# EAGLE design so-indicators-ok (EAGLE 6.6.0)
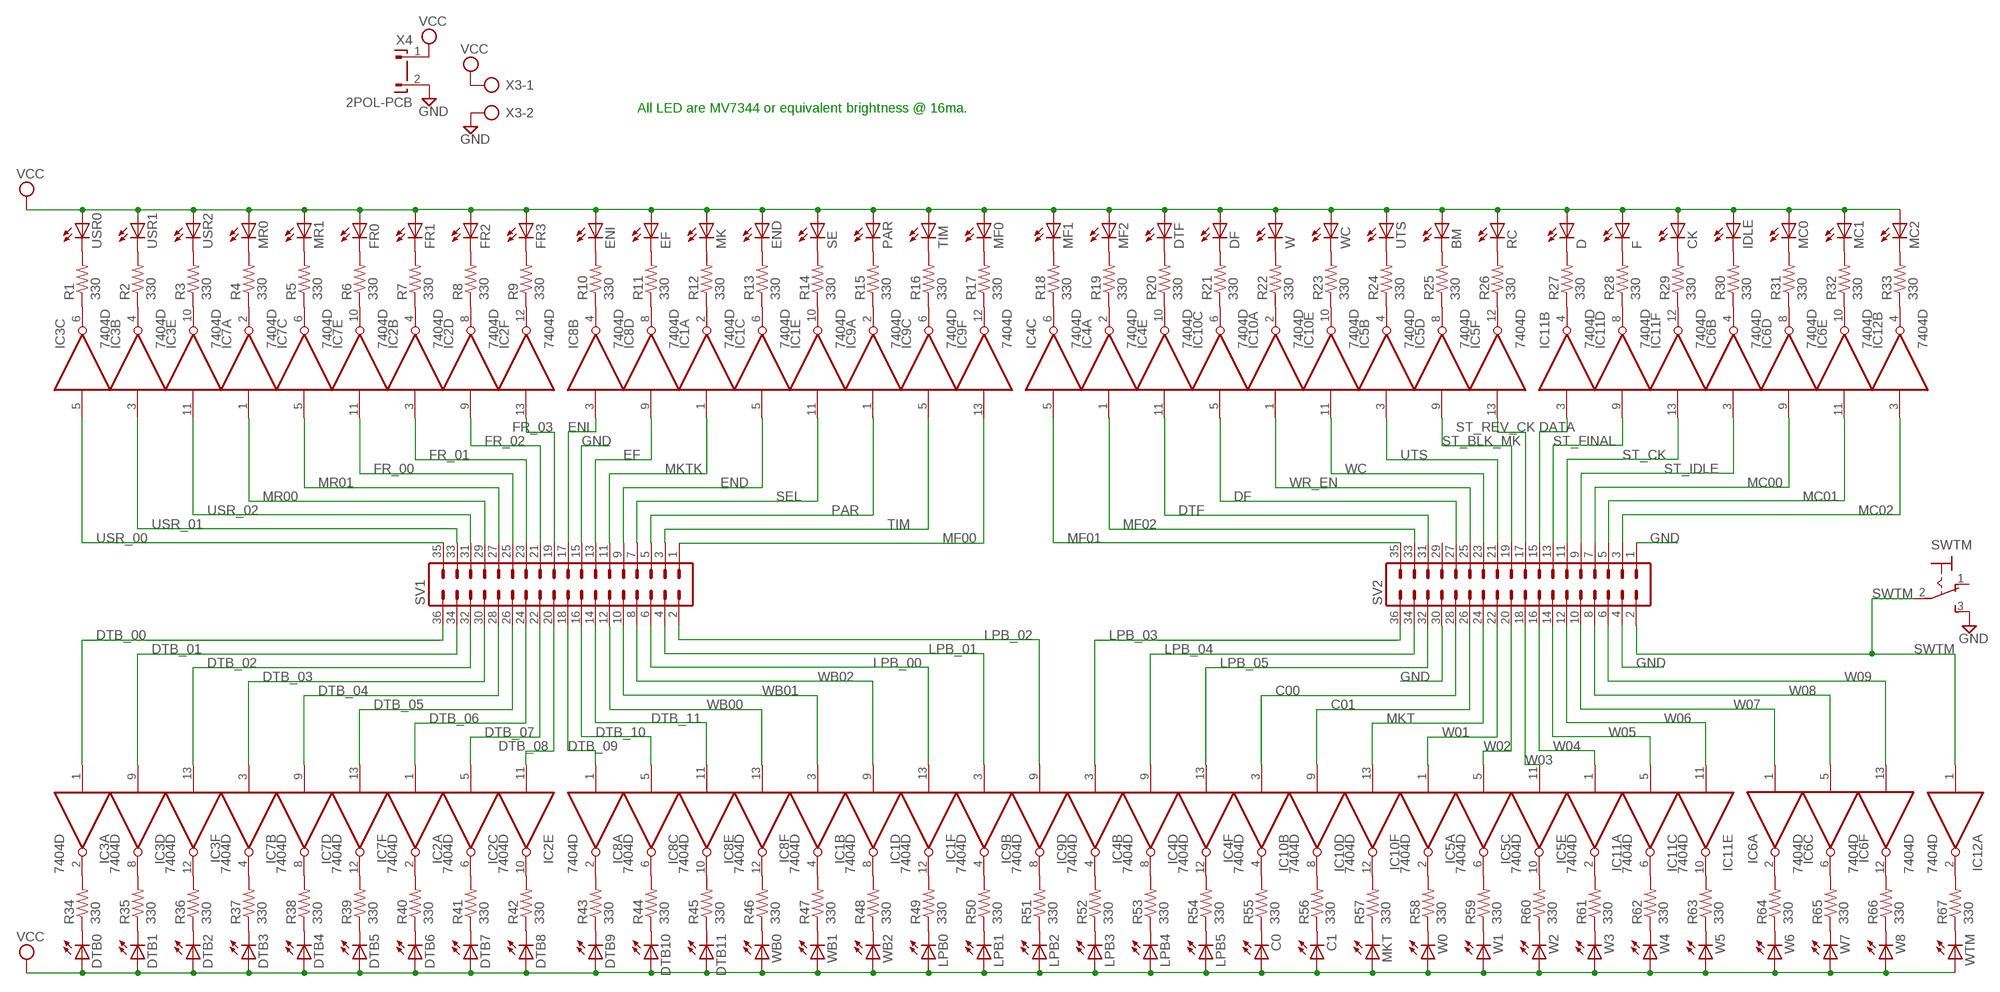
[diagram p0: schematic, sheet 1]

## Parts
BM  LED5MM  [LED5MM]
C0  LED5MM  [LED5MM]
C1  LED5MM  [LED5MM]
CK  LED5MM  [LED5MM]
D  LED5MM  [LED5MM]
DF  LED5MM  [LED5MM]
DTB0  LED5MM  [LED5MM]
DTB1  LED5MM  [LED5MM]
DTB2  LED5MM  [LED5MM]
DTB3  LED5MM  [LED5MM]
DTB4  LED5MM  [LED5MM]
DTB5  LED5MM  [LED5MM]
DTB6  LED5MM  [LED5MM]
DTB7  LED5MM  [LED5MM]
DTB8  LED5MM  [LED5MM]
DTB9  LED5MM  [LED5MM]
DTB10  LED5MM  [LED5MM]
DTB11  LED5MM  [LED5MM]
DTF  LED5MM  [LED5MM]
EF  LED5MM  [LED5MM]
END  LED5MM  [LED5MM]
ENI  LED5MM  [LED5MM]
F  LED5MM  [LED5MM]
FR0  LED5MM  [LED5MM]
FR1  LED5MM  [LED5MM]
FR2  LED5MM  [LED5MM]
FR3  LED5MM  [LED5MM]
IC1  7404D  [SO14]
IC2  7404D  [SO14]
IC3  7404D  [SO14]
IC4  7404D  [SO14]
IC5  7404D  [SO14]
IC6  7404D  [SO14]
IC7  7404D  [SO14]
IC8  7404D  [SO14]
IC9  7404D  [SO14]
IC10  7404D  [SO14]
IC11  7404D  [SO14]
IC12  7404D  [SO14]
IDLE  LED5MM  [LED5MM]
LPB0  LED5MM  [LED5MM]
LPB1  LED5MM  [LED5MM]
LPB2  LED5MM  [LED5MM]
LPB3  LED5MM  [LED5MM]
LPB4  LED5MM  [LED5MM]
LPB5  LED5MM  [LED5MM]
MC0  LED5MM  [LED5MM]
MC1  LED5MM  [LED5MM]
MC2  LED5MM  [LED5MM]
MF0  LED5MM  [LED5MM]
MF1  LED5MM  [LED5MM]
MF2  LED5MM  [LED5MM]
MK  LED5MM  [LED5MM]
MKT  LED5MM  [LED5MM]
MR0  LED5MM  [LED5MM]
MR1  LED5MM  [LED5MM]
PAR  LED5MM  [LED5MM]
R1  330  R-US_0207/10  [0207/10]
R2  330  R-US_0207/10  [0207/10]
R3  330  R-US_0207/10  [0207/10]
R4  330  R-US_0207/10  [0207/10]
R5  330  R-US_0207/10  [0207/10]
R6  330  R-US_0207/10  [0207/10]
R7  330  R-US_0207/10  [0207/10]
R8  330  R-US_0207/10  [0207/10]
R9  330  R-US_0207/10  [0207/10]
R10  330  R-US_0207/10  [0207/10]
R11  330  R-US_0207/10  [0207/10]
R12  330  R-US_0207/10  [0207/10]
R13  330  R-US_0207/10  [0207/10]
R14  330  R-US_0207/10  [0207/10]
R15  330  R-US_0207/10  [0207/10]
R16  330  R-US_0207/10  [0207/10]
R17  330  R-US_0207/10  [0207/10]
R18  330  R-US_0207/10  [0207/10]
R19  330  R-US_0207/10  [0207/10]
R20  330  R-US_0207/10  [0207/10]
R21  330  R-US_0207/10  [0207/10]
R22  330  R-US_0207/10  [0207/10]
R23  330  R-US_0207/10  [0207/10]
R24  330  R-US_0207/10  [0207/10]
R25  330  R-US_0207/10  [0207/10]
R26  330  R-US_0207/10  [0207/10]
R27  330  R-US_0207/10  [0207/10]
R28  330  R-US_0207/10  [0207/10]
R29  330  R-US_0207/10  [0207/10]
R30  330  R-US_0207/10  [0207/10]
R31  330  R-US_0207/10  [0207/10]
R32  330  R-US_0207/10  [0207/10]
R33  330  R-US_0207/10  [0207/10]
R34  330  R-US_0207/10  [0207/10]
R35  330  R-US_0207/10  [0207/10]
R36  330  R-US_0207/10  [0207/10]
R37  330  R-US_0207/10  [0207/10]
R38  330  R-US_0207/10  [0207/10]
R39  330  R-US_0207/10  [0207/10]
R40  330  R-US_0207/10  [0207/10]
R41  330  R-US_0207/10  [0207/10]
R42  330  R-US_0207/10  [0207/10]
R43  330  R-US_0207/10  [0207/10]
R44  330  R-US_0207/10  [0207/10]
R45  330  R-US_0207/10  [0207/10]
R46  330  R-US_0207/10  [0207/10]
R47  330  R-US_0207/10  [0207/10]
R48  330  R-US_0207/10  [0207/10]
R49  330  R-US_0207/10  [0207/10]
R50  330  R-US_0207/10  [0207/10]
R51  330  R-US_0207/10  [0207/10]
R52  330  R-US_0207/10  [0207/10]
R53  330  R-US_0207/10  [0207/10]
R54  330  R-US_0207/10  [0207/10]
R55  330  R-US_0207/10  [0207/10]
R56  330  R-US_0207/10  [0207/10]
R57  330  R-US_0207/10  [0207/10]
R58  330  R-US_0207/10  [0207/10]
R59  330  R-US_0207/10  [0207/10]
R60  330  R-US_0207/10  [0207/10]
R61  330  R-US_0207/10  [0207/10]
R62  330  R-US_0207/10  [0207/10]
R63  330  R-US_0207/10  [0207/10]
R64  330  R-US_0207/10  [0207/10]
R65  330  R-US_0207/10  [0207/10]
R66  330  R-US_0207/10  [0207/10]
R67  330  R-US_0207/10  [0207/10]
RC  LED5MM  [LED5MM]
SE  LED5MM  [LED5MM]
SV1  MA18-2  [MA18-2]
SV2  MA18-2  [MA18-2]
SWTM  M9040P  [M9040P]
TIM  LED5MM  [LED5MM]
USR0  LED5MM  [LED5MM]
USR1  LED5MM  [LED5MM]
USR2  LED5MM  [LED5MM]
UTS  LED5MM  [LED5MM]
W  LED5MM  [LED5MM]
W0  LED5MM  [LED5MM]
W1  LED5MM  [LED5MM]
W2  LED5MM  [LED5MM]
W3  LED5MM  [LED5MM]
W4  LED5MM  [LED5MM]
W5  LED5MM  [LED5MM]
W6  LED5MM  [LED5MM]
W7  LED5MM  [LED5MM]
W8  LED5MM  [LED5MM]
WB0  LED5MM  [LED5MM]
WB1  LED5MM  [LED5MM]
WB2  LED5MM  [LED5MM]
WC  LED5MM  [LED5MM]
WTM  LED5MM  [LED5MM]
X3  AK300/2  [AK300/2]
X4  2POL-PCB  [2POL-PCB]

## Nets
C00: IC10.3(B:I) SV2.28
C01: IC10.9(D:I) SV2.26
DATA: IC11.3(B:I) SV2.15
DF: IC10.5(C:I) SV2.27
DTB_00: IC3.1(A:I) SV1.36
DTB_01: IC3.9(D:I) SV1.34
DTB_02: IC3.13(F:I) SV1.32
DTB_03: IC7.3(B:I) SV1.30
DTB_04: IC7.9(D:I) SV1.28
DTB_05: IC7.13(F:I) SV1.26
DTB_06: IC2.1(A:I) SV1.24
DTB_07: IC2.5(C:I) SV1.22
DTB_08: IC2.11(E:I) SV1.20
DTB_09: IC8.1(A:I) SV1.18
DTB_10: IC8.5(C:I) SV1.16
DTB_11: IC8.11(E:I) SV1.14
DTF: IC4.11(E:I) SV2.31
EF: IC8.9(D:I) SV1.13
END: IC1.5(C:I) SV1.9
ENI: IC8.3(B:I) SV1.17
FR_00: IC7.11(E:I) SV1.25
FR_01: IC2.3(B:I) SV1.23
FR_02: IC2.9(D:I) SV1.21
FR_03: IC2.13(F:I) SV1.19
GND: SV1.15 SV2.1 SV2.4 SV2.30 SWTM.3(S) X3.2 X4.2
LPB_00: IC1.13(F:I) SV1.6
LPB_01: IC9.3(B:I) SV1.4
LPB_02: IC9.9(D:I) SV1.2
LPB_03: IC4.3(B:I) SV2.36
LPB_04: IC4.9(D:I) SV2.34
LPB_05: IC4.13(F:I) SV2.32
MC00: IC6.9(D:I) SV2.7
MC01: IC6.11(E:I) SV2.5
MC02: IC12.3(B:I) SV2.3
MF00: IC9.13(F:I) SV1.1
MF01: IC4.5(C:I) SV2.35
MF02: IC4.1(A:I) SV2.33
MKT: IC10.13(F:I) SV2.24
MKTK: IC1.1(A:I) SV1.11
MR00: IC7.1(A:I) SV1.29
MR01: IC7.5(C:I) SV1.27
N$1: R1.2 USR0.K(C)
N$2: R2.2 USR1.K(C)
N$3: R3.2 USR2.K(C)
N$4: MR0.K(C) R4.2
N$5: MR1.K(C) R5.2
N$6: FR0.K(C) R6.2
N$7: FR1.K(C) R7.2
N$8: FR2.K(C) R8.2
N$9: FR3.K(C) R9.2
N$10: ENI.K(C) R10.2
N$11: EF.K(C) R11.2
N$12: MK.K(C) R12.2
N$13: END.K(C) R13.2
N$14: R14.2 SE.K(C)
N$15: PAR.K(C) R15.2
N$16: R16.2 TIM.K(C)
N$17: MF0.K(C) R17.2
N$18: MF1.K(C) R18.2
N$19: MF2.K(C) R19.2
N$20: IC3.6(C:O) R1.1
N$21: IC3.4(B:O) R2.1
N$22: IC3.10(E:O) R3.1
N$23: IC7.2(A:O) R4.1
N$24: IC7.6(C:O) R5.1
N$25: IC7.10(E:O) R6.1
N$26: IC2.4(B:O) R7.1
N$27: IC2.8(D:O) R8.1
N$28: IC2.12(F:O) R9.1
N$29: IC8.4(B:O) R10.1
N$30: IC8.8(D:O) R11.1
N$31: IC1.2(A:O) R12.1
N$32: IC1.6(C:O) R13.1
N$33: IC1.10(E:O) R14.1
N$34: IC9.2(A:O) R15.1
N$35: IC9.6(C:O) R16.1
N$36: IC9.12(F:O) R17.1
N$37: IC4.6(C:O) R18.1
N$38: DTF.K(C) R20.2
N$57: DF.K(C) R21.2
N$58: R22.2 W.K(C)
N$59: R23.2 WC.K(C)
N$60: R24.2 UTS.K(C)
N$61: BM.K(C) R25.2
N$62: R26.2 RC.K(C)
N$63: D.K(C) R27.2
N$64: F.K(C) R28.2
N$65: CK.K(C) R29.2
N$66: IDLE.K(C) R30.2
N$67: MC0.K(C) R31.2
N$68: MC1.K(C) R32.2
N$69: MC2.K(C) R33.2
N$70: IC4.2(A:O) R19.1
N$71: IC4.10(E:O) R20.1
N$72: IC10.6(C:O) R21.1
N$73: IC10.10(E:O) R23.1
N$74: IC10.2(A:O) R22.1
N$75: IC5.4(B:O) R24.1
N$76: IC5.8(D:O) R25.1
N$77: IC5.12(F:O) R26.1
N$78: IC11.4(B:O) R27.1
N$79: IC11.8(D:O) R28.1
N$80: IC11.12(F:O) R29.1
N$81: IC6.4(B:O) R30.1
N$82: IC6.8(D:O) R31.1
N$83: IC6.10(E:O) R32.1
N$84: IC12.4(B:O) R33.1
N$89: DTB0.K(C) R34.1
N$90: DTB1.K(C) R35.1
N$91: DTB2.K(C) R36.1
N$92: DTB3.K(C) R37.1
N$93: DTB4.K(C) R38.1
N$94: DTB5.K(C) R39.1
N$95: DTB6.K(C) R40.1
N$96: DTB7.K(C) R41.1
N$97: DTB8.K(C) R42.1
N$98: DTB9.K(C) R43.1
N$99: DTB10.K(C) R44.1
N$100: DTB11.K(C) R45.1
N$101: R46.1 WB0.K(C)
N$102: R47.1 WB1.K(C)
N$103: R48.1 WB2.K(C)
N$104: LPB0.K(C) R49.1
N$105: LPB1.K(C) R50.1
N$106: LPB2.K(C) R51.1
N$107: LPB3.K(C) R52.1
N$108: LPB4.K(C) R53.1
N$109: LPB5.K(C) R54.1
N$110: C0.K(C) R55.1
N$111: C1.K(C) R56.1
N$112: MKT.K(C) R57.1
N$113: R58.1 W0.K(C)
N$114: R59.1 W1.K(C)
N$115: R60.1 W2.K(C)
N$116: R61.1 W3.K(C)
N$117: R62.1 W4.K(C)
N$118: R63.1 W5.K(C)
N$119: R64.1 W6.K(C)
N$120: R65.1 W7.K(C)
N$121: R66.1 W8.K(C)
N$122: R67.1 WTM.K(C)
N$123: IC3.2(A:O) R34.2
N$124: IC3.8(D:O) R35.2
N$125: IC3.12(F:O) R36.2
N$126: IC7.4(B:O) R37.2
N$127: IC7.8(D:O) R38.2
N$128: IC7.12(F:O) R39.2
N$129: IC2.2(A:O) R40.2
N$130: IC2.6(C:O) R41.2
N$131: IC2.10(E:O) R42.2
N$132: IC8.2(A:O) R43.2
N$133: IC8.6(C:O) R44.2
N$134: IC8.10(E:O) R45.2
N$135: IC8.12(F:O) R46.2
N$136: IC1.4(B:O) R47.2
N$137: IC1.8(D:O) R48.2
N$138: IC1.12(F:O) R49.2
N$139: IC9.4(B:O) R50.2
N$140: IC9.8(D:O) R51.2
N$141: IC4.4(B:O) R52.2
N$142: IC4.8(D:O) R53.2
N$143: IC4.12(F:O) R54.2
N$144: IC10.4(B:O) R55.2
N$145: IC10.8(D:O) R56.2
N$146: IC10.12(F:O) R57.2
N$147: IC5.2(A:O) R58.2
N$148: IC5.6(C:O) R59.2
N$149: IC5.10(E:O) R60.2
N$150: IC11.2(A:O) R61.2
N$151: IC11.6(C:O) R62.2
N$152: IC11.10(E:O) R63.2
N$153: IC6.2(A:O) R64.2
N$154: IC6.6(C:O) R65.2
N$155: IC6.12(F:O) R66.2
N$190: IC12.2(A:O) R67.2
PAR: IC9.1(A:I) SV1.5
SEL: IC1.11(E:I) SV1.7
ST_BLK_MK: IC5.9(D:I) SV2.19
ST_CK: IC11.13(F:I) SV2.11
ST_FINAL: IC11.9(D:I) SV2.13
ST_IDLE: IC6.3(B:I) SV2.9
ST_REV_CK: IC5.13(F:I) SV2.17
SWTM: IC12.1(A:I) SV2.2 SWTM.2(P)
TIM: IC9.5(C:I) SV1.3
USR_00: IC3.5(C:I) SV1.35
USR_01: IC3.3(B:I) SV1.33
USR_02: IC3.11(E:I) SV1.31
UTS: IC5.3(B:I) SV2.21
VCC: BM.A C0.A C1.A CK.A D.A DF.A DTB0.A DTB1.A DTB2.A DTB3.A DTB4.A DTB5.A DTB6.A DTB7.A DTB8.A DTB9.A DTB10.A DTB11.A DTF.A EF.A END.A ENI.A F.A FR0.A FR1.A FR2.A FR3.A IDLE.A LPB0.A LPB1.A LPB2.A LPB3.A LPB4.A LPB5.A MC0.A MC1.A MC2.A MF0.A MF1.A MF2.A MK.A MKT.A MR0.A MR1.A PAR.A RC.A SE.A TIM.A USR0.A USR1.A USR2.A UTS.A W0.A W1.A W2.A W3.A W4.A W5.A W6.A W7.A W8.A W.A WB0.A WB1.A WB2.A WC.A WTM.A X3.1 X4.1
W01: IC5.1(A:I) SV2.22
W02: IC5.5(C:I) SV2.20
W03: IC5.11(E:I) SV2.18
W04: IC11.1(A:I) SV2.16
W05: IC11.5(C:I) SV2.14
W06: IC11.11(E:I) SV2.12
W07: IC6.1(A:I) SV2.10
W08: IC6.5(C:I) SV2.8
W09: IC6.13(F:I) SV2.6
WB00: IC8.13(F:I) SV1.12
WB01: IC1.3(B:I) SV1.10
WB02: IC1.9(D:I) SV1.8
WC: IC10.11(E:I) SV2.23
WR_EN: IC10.1(A:I) SV2.25
Unconnected: IC9.10(E:O) IC9.11(E:I) IC12.5(C:I) IC12.6(C:O) IC12.8(D:O) IC12.9(D:I) IC12.10(E:O) IC12.11(E:I) IC12.12(F:O) IC12.13(F:I) SV2.29 SWTM.1(O)

## Notes on the sheet
- All LED are MV7344 or equivalent brightness @ 16ma.

## Power pins joined to a net without a drawn wire
GND: IC1.7(P:GND) IC2.7(P:GND) IC3.7(P:GND) IC4.7(P:GND) IC5.7(P:GND) IC6.7(P:GND) IC7.7(P:GND) IC8.7(P:GND) IC9.7(P:GND) IC10.7(P:GND) IC11.7(P:GND) IC12.7(P:GND)
VCC: IC1.14(P:VCC) IC2.14(P:VCC) IC3.14(P:VCC) IC4.14(P:VCC) IC5.14(P:VCC) IC6.14(P:VCC) IC7.14(P:VCC) IC8.14(P:VCC) IC9.14(P:VCC) IC10.14(P:VCC) IC11.14(P:VCC) IC12.14(P:VCC)

## Library data of the parts
BM C0 C1 CK D DF DTB0 DTB1-DTB11 DTF EF END ENI F FR0 FR1-FR3 IDLE LPB0 LPB1-LPB5 MC0 MC1 MC2 MF0 MF1 MF2 MK MKT MR0 MR1 PAR RC SE TIM USR0 USR1 USR2 UTS W W0 W1-W8 WB0 WB1 WB2 WC WTM = led:LED: LED OSRAM: - CHIPLED LG R971, LG N971, LY N971, LG Q971, LY Q971, LO R971, LY R971 LH N974, LH R974 LS Q976, LO Q976, LY Q976 LO Q996 - Hyper CHIPLED LW Q18S LB Q993, LB Q99A, LB R99A - SideLED LS A670, LO A670, LY A670, LG A670, LP A670 LB A673, LV A673, LT A673, LW A673 LH A674 LY A675 LS A676, LA A676, LO A676, LY A676, LW A676 LS A679, LY A679, LG A679 - Hyper Micro SIDELED® LS Y876, LA Y876, LO Y876, LY Y876 LT Y87S - SmartLED LW L88C, LW L88S LB L89C, LB L89S, LG L890 LS L89K, LO L89K, LY L89K LS L896, LA L896, LO L896, LY L896 - TOPLED LS T670, LO T670, LY T670, LG T670, LP T670 LSG T670, LSP T670, LSY T670, LOP T670, LYG T670 LG T671, LOG T671, LSG T671 LB T673, LV T673, LT T673, LW T673 LH T674 LS T676, LA T676, LO T676, LY T676, LB T676, LH T676, LSB T676, LW T676 LB T67C, LV T67C, LT T67C, LS T67K, LO T67K, LY T67K, LW E67C LS E67B, LA E67B, LO E67B, LY E67B, LB E67C, LV E67C, LT E67C LW T67C LS T679, LY T679, LG T679 LS T770, LO T770, LY T770, LG T770, LP T770 LB T773, LV T773, LT T773, LW T773 LH T774 LS E675, LA E675, LY E675, LS T675 LS T776, LA T776, LO T776, LY T776, LB T776 LHGB T686 LT T68C, LB T68C - Hyper Mini TOPLED® LB M676 - Mini TOPLED Santana® LG M470 LS M47K, LO M47K, LY M47K Source: http://www.osram.convergy.de LUXEON: - LUMILED® LXK2-PW12-R00, LXK2-PW12-S00, LXK2-PW14-U00, LXK2-PW14-V00 LXK2-PM12-R00, LXK2-PM12-S00, LXK2-PM14-U00 LXK2-PE12-Q00, LXK2-PE12-R00, LXK2-PE12-S00, LXK2-PE14-T00, LXK2-PE14-U00 LXK2-PB12-K00, LXK2-PB12-L00, LXK2-PB12-M00, LXK2-PB14-N00, LXK2-PB14-P00, LXK2-PB14-Q00 LXK2-PR12-L00, LXK2-PR12-M00, LXK2-PR14-Q00, LXK2-PR14-R00 LXK2-PD12-Q00, LXK2-PD12-R00, LXK2-PD12-S00 LXK2-PH12-R00, LXK2-PH12-S00 LXK2-PL12-P00, LXK2-PL12-Q00, LXK2-PL12-R00 Source: www.luxeon.com KINGBRIGHT: KA-3528ASYC Source: www.kingbright.com
IC1-IC12 = 74xx-us:74*04: Hex INVERTER
R1-R67 = rcl:R-US_: RESISTOR, American symbol
SV1 SV2 = con-lstb:MA18-2: PIN HEADER; OC_FARNELL: unknown; OC_NEWARK: unknown
SWTM = switch:M9040P: TOGGLE SWITCH Marquardt
X3 = con-ptr500:AK300/2: CONNECTOR; OC_FARNELL: unknown; OC_NEWARK: unknown
X4 = con-friwo:2POL-PCB: PCB SUPPLY CONNECTOR FRIWO (TEXAS); OC_FARNELL: unknown; OC_NEWARK: unknown

## Board
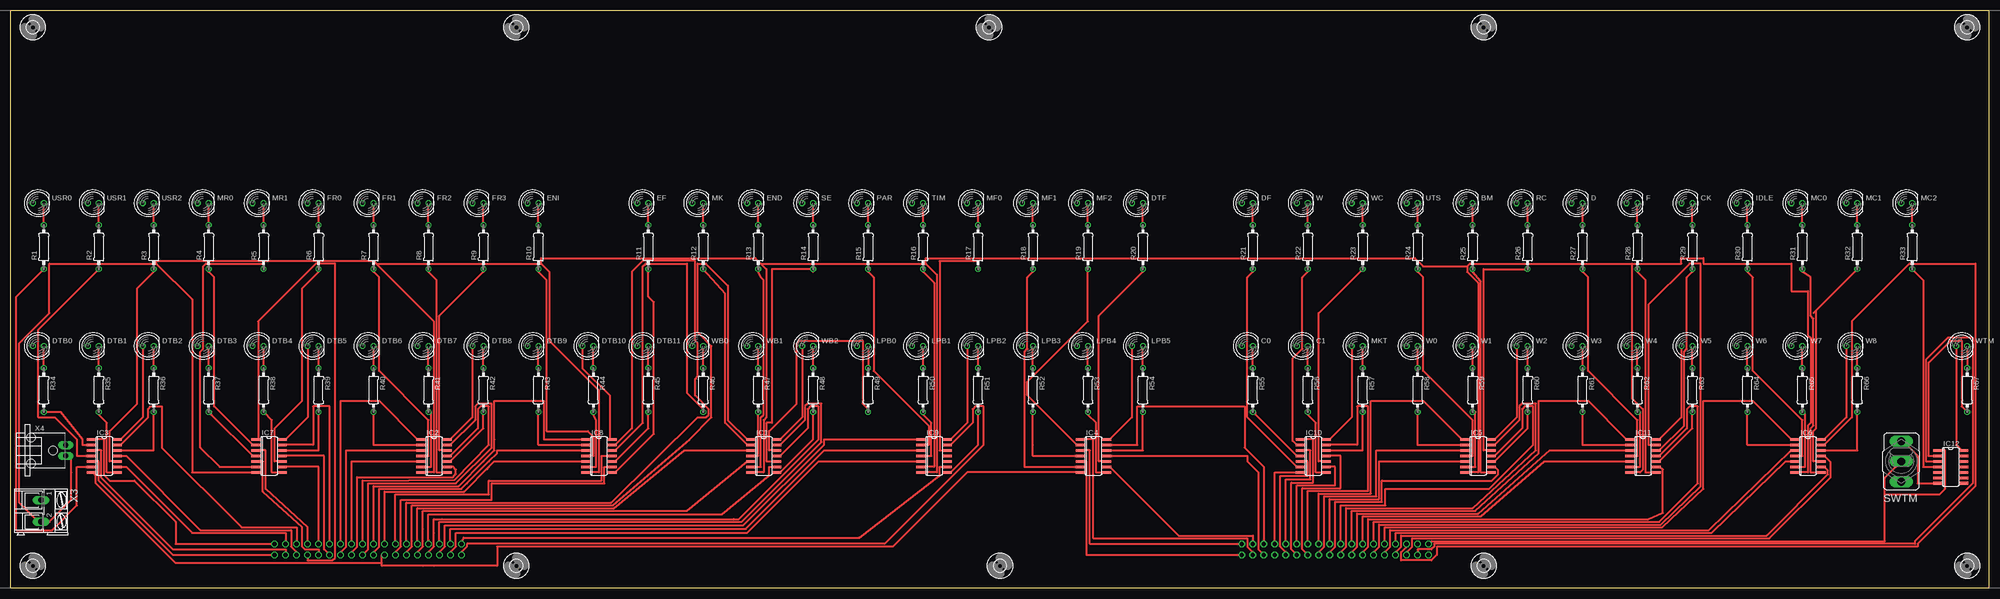
[diagram p1: board, top side]
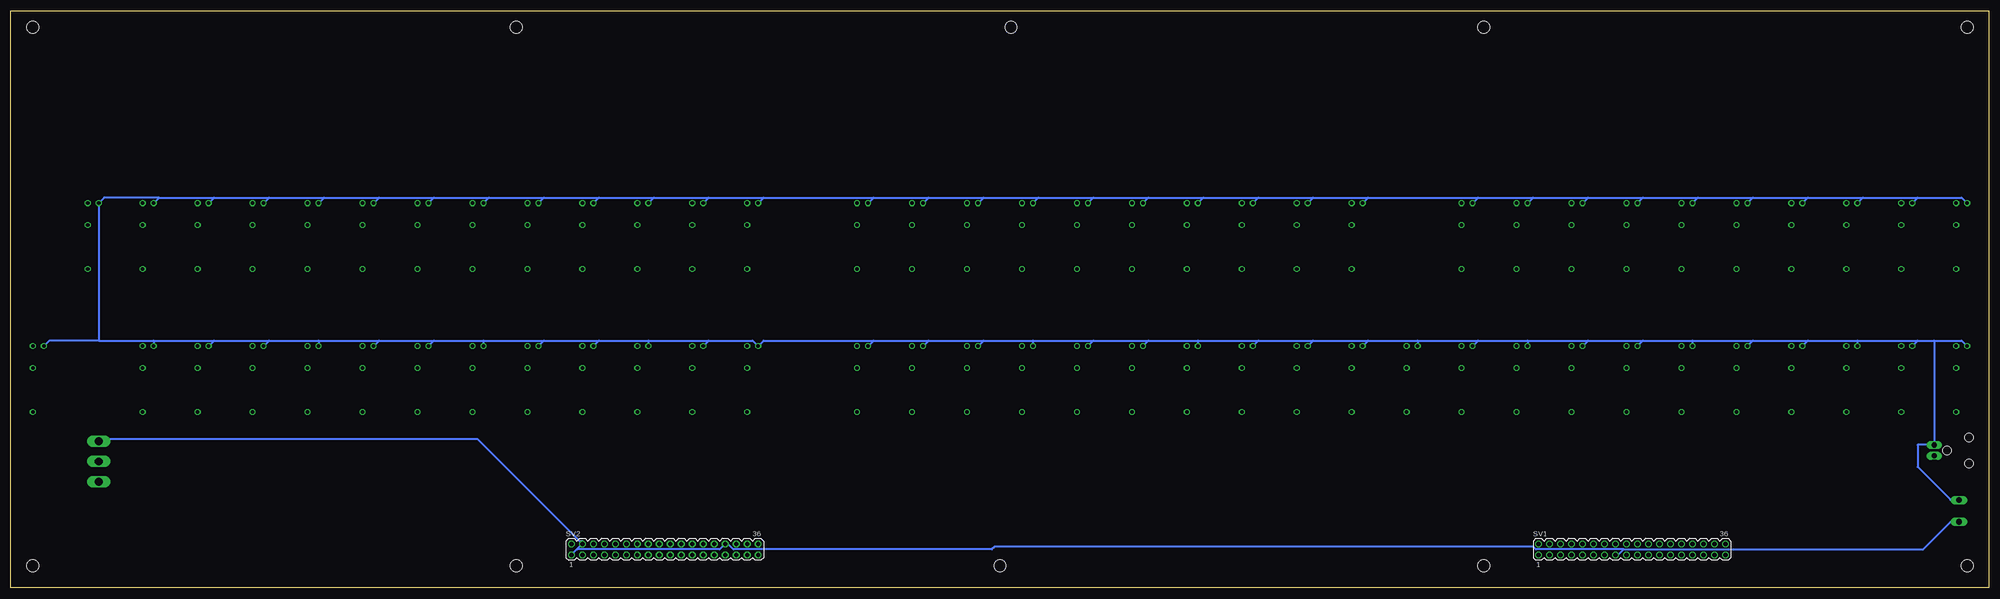
[diagram p2: board, bottom side, seen from below]

Size 457.2 x 133.35 mm. Coordinates in mm from the lower left corner, seen from the top.
Outline: 0,0 457.2,0 457.2,133.35 0,133.35 0,0
Copper layers (1*16): Top 0.035mm / dielectric 1.5mm / Bottom 0.035mm
Design rules "default *": minimum track width 10mil, minimum drill 24mil, track to track 8mil, track to pad 8mil, pad to pad 8mil, via to via 8mil, smd to smd 8mil, copper to edge 40mil, drill to drill 8mil, minimum pad ring 10mil, minimum via ring 8mil, stop-mask expansion 4mil, vias tented up to drill 0mil, thermal gap 10mil

### Footprints (pad centres in the part's own frame; a part is rotated, then mirrored left to right if it is on the bottom)
LED5MM = drill 0.813 octagon: A -1.27,0; K 1.27,0
SO14 = smd 0.66 x 2.032: 1 -3.81,-3.073; 2 -2.54,-3.073; 3 -1.27,-3.073; 4 0,-3.073; 5 1.27,-3.073; 6 2.54,-3.073; 7 3.81,-3.073; 8 3.81,3.073; 9 2.54,3.073; 10 1.27,3.073; 11 0,3.073; 12 -1.27,3.073; 13 -2.54,3.073; 14 -3.81,3.073
0207/10 = drill 0.813 octagon: 1 -5.08,0; 2 5.08,0
MA18-2 = drill 1.016 octagon: 1 -21.59,-1.27; 2 -21.59,1.27; 3 -19.05,-1.27; 4 -19.05,1.27; 5 -16.51,-1.27; 6 -16.51,1.27; 7 -13.97,-1.27; 8 -13.97,1.27; 9 -11.43,-1.27; 10 -11.43,1.27; 11 -8.89,-1.27; 12 -8.89,1.27; 13 -6.35,-1.27; 14 -6.35,1.27; 15 -3.81,-1.27; 16 -3.81,1.27; 17 -1.27,-1.27; 18 -1.27,1.27; 19 1.27,-1.27; 20 1.27,1.27; 21 3.81,-1.27; 22 3.81,1.27; 23 6.35,-1.27; 24 6.35,1.27; 25 8.89,-1.27; 26 8.89,1.27; 27 11.43,-1.27; 28 11.43,1.27; 29 13.97,-1.27; 30 13.97,1.27; 31 16.51,-1.27; 32 16.51,1.27; 33 19.05,-1.27; 34 19.05,1.27; 35 21.59,-1.27; 36 21.59,1.27
M9040P = drill 1.803 long: 1 0,4.699; 2 0,0; 3 0,-4.699
2,8 = hole 2.8: 0,0
AK300/2 = drill 1.321 long: 1 -2.515,0; 2 2.489,0
2POL-PCB = drill 1.2 long: 1 -1.25,11.6; 2 1.25,11.6 | hole 2: -3,3.6; 3,3.6; 0,8.6

### Placement (x,y rotation side)
BM  336.55,88.9 0 top
C0  285.75,55.88 0 top
C1  298.45,55.88 0 top
CK  387.35,88.9 0 top
D  361.95,88.9 0 top
DF  285.75,88.9 0 top
DTB0  6.35,55.88 0 top
DTB1  19.05,55.88 0 top
DTB2  31.75,55.88 0 top
DTB3  44.45,55.88 0 top
DTB4  57.15,55.88 0 top
DTB5  69.85,55.88 0 top
DTB6  82.55,55.88 0 top
DTB7  95.25,55.88 0 top
DTB8  107.95,55.88 0 top
DTB9  120.65,55.88 0 top
DTB10  133.35,55.88 0 top
DTB11  146.05,55.88 0 top
DTF  260.35,88.9 0 top
EF  146.05,88.9 0 top
END  171.45,88.9 0 top
ENI  120.65,88.9 0 top
F  374.65,88.9 0 top
FR0  69.85,88.9 0 top
FR1  82.55,88.9 0 top
FR2  95.25,88.9 0 top
FR3  107.95,88.9 0 top
IC1  173.99,30.48 270 top
IC2  97.79,30.48 270 top
IC3  21.59,30.48 270 top
IC4  250.19,30.48 270 top
IC5  339.09,30.48 270 top
IC6  415.29,30.48 270 top
IC7  59.69,30.48 270 top
IC8  135.89,30.48 270 top
IC9  213.36,30.48 270 top
IC10  300.99,30.48 270 top
IC11  377.19,30.48 270 top
IC12  448.31,27.94 270 top
IDLE  400.05,88.9 0 top
LPB0  196.85,55.88 0 top
LPB1  209.55,55.88 0 top
LPB2  222.25,55.88 0 top
LPB3  234.95,55.88 0 top
LPB4  247.65,55.88 0 top
LPB5  260.35,55.88 0 top
MC0  412.75,88.9 0 top
MC1  425.45,88.9 0 top
MC2  438.15,88.9 0 top
MF0  222.25,88.9 0 top
MF1  234.95,88.9 0 top
MF2  247.65,88.9 0 top
MK  158.75,88.9 0 top
MKT  311.15,55.88 0 top
MR0  44.45,88.9 0 top
MR1  57.15,88.9 0 top
PAR  196.85,88.9 0 top
R1  7.62,78.74 90 top
R2  20.32,78.74 90 top
R3  33.02,78.74 90 top
R4  45.72,78.74 90 top
R5  58.42,78.74 90 top
R6  71.12,78.74 90 top
R7  83.82,78.74 90 top
R8  96.52,78.74 90 top
R9  109.22,78.74 90 top
R10  121.92,78.74 90 top
R11  147.32,78.74 90 top
R12  160.02,78.74 90 top
R13  172.72,78.74 90 top
R14  185.42,78.74 90 top
R15  198.12,78.74 90 top
R16  210.82,78.74 90 top
R17  223.52,78.74 90 top
R18  236.22,78.74 90 top
R19  248.92,78.74 90 top
R20  261.62,78.74 90 top
R21  287.02,78.74 90 top
R22  299.72,78.74 90 top
R23  312.42,78.74 90 top
R24  325.12,78.74 90 top
R25  337.82,78.74 90 top
R26  350.52,78.74 90 top
R27  363.22,78.74 90 top
R28  375.92,78.74 90 top
R29  388.62,78.74 90 top
R30  401.32,78.74 90 top
R31  414.02,78.74 90 top
R32  426.72,78.74 90 top
R33  439.42,78.74 90 top
R34  7.62,45.72 270 top
R35  20.32,45.72 270 top
R36  33.02,45.72 270 top
R37  45.72,45.72 270 top
R38  58.42,45.72 270 top
R39  71.12,45.72 270 top
R40  83.82,45.72 270 top
R41  96.52,45.72 270 top
R42  109.22,45.72 270 top
R43  121.92,45.72 270 top
R44  134.62,45.72 270 top
R45  147.32,45.72 270 top
R46  160.02,45.72 270 top
R47  172.72,45.72 270 top
R48  185.42,45.72 270 top
R49  198.12,45.72 270 top
R50  210.82,45.72 270 top
R51  223.52,45.72 270 top
R52  236.22,45.72 270 top
R53  248.92,45.72 270 top
R54  261.62,45.72 270 top
R55  287.02,45.72 270 top
R56  299.72,45.72 270 top
R57  312.42,45.72 270 top
R58  325.12,45.72 270 top
R59  337.82,45.72 270 top
R60  350.52,45.72 270 top
R61  363.22,45.72 270 top
R62  375.92,45.72 270 top
R63  388.62,45.72 270 top
R64  401.32,45.72 270 top
R65  414.02,45.72 270 top
R66  426.72,45.72 270 top
R67  452.12,45.72 270 top
RC  349.25,88.9 0 top
SE  184.15,88.9 0 top
SV1  82.55,8.89 0 bottom
SV2  306.07,8.89 0 bottom
SWTM  436.88,29.21 180 top
TIM  209.55,88.9 0 top
U$1  [2,8]  5.08,5.08 0 top
U$2  [2,8]  5.08,129.54 0 top
U$3  [2,8]  116.84,5.08 0 top
U$4  [2,8]  116.84,129.54 0 top
U$5  [2,8]  226.06,129.54 0 top
U$6  [2,8]  228.6,5.08 0 top
U$7  [2,8]  340.36,129.54 0 top
U$8  [2,8]  340.36,5.08 0 top
U$9  [2,8]  452.12,129.54 0 top
U$10  [2,8]  452.12,5.08 0 top
USR0  6.35,88.9 0 top
USR1  19.05,88.9 0 top
USR2  31.75,88.9 0 top
UTS  323.85,88.9 0 top
W  298.45,88.9 0 top
W0  323.85,55.88 0 top
W1  336.55,55.88 0 top
W2  349.25,55.88 0 top
W3  361.95,55.88 0 top
W4  374.65,55.88 0 top
W5  387.35,55.88 0 top
W6  400.05,55.88 0 top
W7  412.75,55.88 0 top
W8  425.45,55.88 0 top
WB0  158.75,55.88 0 top
WB1  171.45,55.88 0 top
WB2  184.15,55.88 0 top
WC  311.15,88.9 0 top
WTM  450.85,55.88 0 top
X3  6.99,17.78 270 top
X4  1.11,31.75 270 top

### Tracks (layer width: path | path; a pad name or v marks a point on that pad's centre or on a via)
C00
  Top 0.406: IC10.3 300.36,31.75 300.36,25.08 294.64,25.08 SV2.28
C01
  Top 0.406: IC10.9 306.07,27.94 306.07,23.65 297.18,23.65 SV2.26
DATA
  Top 0.406: 355.6,31.75 IC11.3 355.6,31.75 | 355.6,31.75 339.09,17.15 311.15,17.15 311.15,9.53 309.88,8.26 SV2.15
DF
  Top 0.406: IC10.5 299.72,29.21 299.72,25.88 293.37,25.88 293.37,9.53 294.64,8.26 SV2.27
DTB_00
  Top 0.406: SV1.36 38.1,10.16 38.1,15.24 28.57,24.77 22.86,24.77 21.59,26.04 21.59,34.29 19.05,34.29 | 19.05,34.29 IC3.1 19.05,34.29
DTB_01
  Top 0.406: SV1.34 63.5,12.7 41.91,12.7 26.67,27.94 25.4,27.94 IC3.9
DTB_02
  Top 0.406: IC3.13 25.4,33.02 31.75,39.37 31.75,41.28 32.38,41.91 34.92,41.91 34.92,32.39 53.34,13.97 66.04,13.97 66.04,10.8 SV1.32
DTB_03
  Top 0.406: IC7.3 57.15,31.75 58.9,31.75 58.9,22.86 68.58,13.97 68.58,10.8 SV1.30
DTB_04
  Top 0.406: SV1.28 71.12,27.94 63.5,27.94 IC7.9
DTB_05
  Top 0.406: SV1.26 73.66,41.91 69.85,41.91 69.85,33.02 63.5,33.02 IC7.13
DTB_06
  Top 0.406: IC2.1 93.98,34.29 85.09,43.18 76.2,43.18 76.2,10.8 SV1.24
DTB_07
  Top 0.406: IC2.5 93.98,29.21 78.74,29.21 78.74,10.8 SV1.22
DTB_08
  Top 0.406: SV1.20 81.28,24.77 102.55,24.92 110.49,33.02 110.49,41.91 108.58,41.91 107.95,41.28 107.95,36.83 101.6,30.48 IC2.11
DTB_09
  Top 0.406: 132.08,34.29 IC8.1 | 132.08,34.29 IC8.1 | 132.08,34.29 IC8.1 | 132.08,34.29 123.19,34.29 123.19,43.18 111.76,43.18 111.76,34.29 111.76,31.75 109.22,29.21 103.5,23.5 83.82,23.5 83.82,10.8 SV1.18 | 132.08,34.29 IC8.1
DTB_10
  Top 0.406: IC8.5 132.08,29.21 111.76,29.21 110.49,27.94 | SV1.16 86.36,10.8 86.36,22.07 86.36,22.23 104.78,22.23 110.49,27.94 | 110.49,27.94 109.86,27.31
DTB_11
  Top 0.406: IC8.11 138.43,30.48 136.53,30.48 136.53,24.77 110.49,24.77 110.49,21.59 88.9,21.59 88.9,10.8 SV1.14
DTF
  Top 0.406: SV2.31 288.29,8.89 288.29,26.67 285.75,29.21 285.75,30.48 254,30.48 IC4.11
EF
  Top 0.406: IC8.9 138.43,27.94 137.16,27.94 137.16,24.13 111.12,24.13 111.12,20.32 90.17,20.32 90.17,10.8 90.17,9.53 88.9,8.26 SV1.13
END
  Top 0.406: IC1.5 170.18,29.21 156.21,17.78 95.25,17.78 95.25,13.65 95.25,10.8 95.25,9.53 93.98,8.26 SV1.9
ENI
  Top 0.406: 83.82,8.26 SV1.17 83.82,8.26 | IC8.3 132.08,31.75 112.39,31.75 112.39,31.12 110.49,29.21 105.41,24.13 104.14,22.86 85.09,22.86 85.09,10.8 85.09,9.53 83.82,8.26
FR_00
  Top 0.406: SV1.25 72.39,8.89 72.39,30.48 63.5,30.48 IC7.11
FR_01
  Top 0.406: IC2.3 93.98,31.75 77.47,31.75 77.47,9.53 76.2,8.26 SV1.23
FR_02
  Top 0.406: IC2.9 102.23,27.94 102.87,27.31 102.87,26.35 102.23,25.56 80.01,25.56 80.01,9.53 78.74,8.26 SV1.21
FR_03
  Top 0.406: SV1.19 82.55,8.89 82.55,22.86 82.55,24.13 101.6,24.13 102.87,24.13 111.12,32.39 111.12,42.55 107.95,42.55 107.31,41.91 107.31,38.74 101.6,33.02 IC2.13
GND
  Top 0.406: SV2.30 292.1,26.67 297.18,26.67 IC10.7 | IC12.7 444.5,24.13 440.69,24.13 440.69,30.48 438.15,33.02 SWTM.3 434.98,33.02 | X4.2 13.97,30.48 13.97,26.67 13.97,20.32 8.89,15.24 X3.2 5.71,15.88 1.91,19.69 1.91,56.52 8.89,63.5 8.89,74.93 33.66,74.93 | 85.72,5.72 38.1,5.72 19.68,24.13 19.68,26.04 19.05,26.67 IC3.7 | 85.72,5.72 85.72,7.62 SV1.15 | 85.72,5.72 85.72,5.08 95.25,5.08 97.79,5.08 112.39,5.08 112.39,9.53 203.84,9.53 220.98,26.67 246.38,26.67 IC4.7 | IC9.7 209.55,26.67 IC9.7 | 336.55,74.3 336.55,73.03 339.09,70.49 339.09,26.67 336.55,26.67 IC5.7 | 336.55,74.3 337.19,74.93 374.65,74.93 | 374.65,74.93 374.65,43.82 377.19,41.28 377.19,27.31 376.56,26.67 374.65,26.67 IC11.7 | 33.66,74.93 41.91,66.68 41.91,26.67 55.88,26.67 IC7.7 | 84.45,74.93 83.82,75.57 33.66,75.57 33.66,74.93 | 84.45,74.93 97.79,61.6 97.79,26.67 95.25,26.67 IC2.7 | 122.56,74.93 124.46,73.03 124.46,57.15 135.89,45.72 135.89,26.67 133.35,26.67 IC8.7 | 84.45,74.93 122.56,74.93 | 173.35,74.93 172.09,76.2 122.56,76.2 122.56,74.93 | 173.35,74.93 174.62,73.66 174.62,39.37 173.99,38.74 173.99,26.67 171.45,26.67 IC1.7 | 211.46,74.93 214,72.39 214,26.67 210.82,26.67 IC9.7 | 173.35,74.93 211.46,74.93 | 336.55,74.3 326.39,74.3 324.49,76.2 211.46,76.2 211.46,74.93 | IC6.7 412.75,26.67 415.29,26.67 415.29,37.47 415.93,38.1 415.93,57.79 415.29,58.42 415.29,68.58 411.48,68.58 411.48,74.93 391.16,74.93 391.16,76.2 386.08,76.2 386.08,74.93 374.65,74.93
  Bottom 0.406: 326.39,8.89 SV2.4 325.12,10.8 325.75,10.8 349.25,34.29 434.34,34.29 SWTM.3 | 326.39,8.89 SV2.1 | 326.39,8.89 293.37,8.89 SV2.30 291.46,10.16 290.19,8.89 230.5,8.89 229.87,9.53 105.41,9.53 104.78,8.89 84.45,8.89 | 84.45,8.89 85.72,7.62 SV1.15 | 84.45,8.89 15.24,8.89 8.89,15.24 X3.2
LPB_00
  Top 0.406: 167.64,15.24 99.06,15.24 99.06,10.8 SV1.6 | 167.64,15.24 | 167.64,15.24 | IC1.13 177.8,33.02 183.51,38.74 183.51,41.91 184.15,42.55 187.32,42.55 187.32,33.66 168.91,15.24 167.64,15.24 | 167.64,15.24 | 167.64,15.24
LPB_01
  Top 0.406: IC9.3 187.96,31.75 169.86,13.65 101.6,13.65 SV1.4
LPB_02
  Top 0.406: IC9.9 215.9,27.94 214.63,27.94 214.63,26.04 196.06,11.59 104.62,11.59 SV1.2
LPB_03
  Top 0.406: IC4.3 249.4,31.75 249.4,26.04 249.4,10.16 SV2.36
LPB_04
  Top 0.406: 254,27.94 IC4.9 254,27.94 | 254,27.94 269.88,12.07 287.02,12.07 287.02,10.8 SV2.34
LPB_05
  Top 0.406: SV2.32 289.56,27.94 285.75,31.75 285.12,32.39 285.12,41.91 260.35,41.91 260.35,33.02 254,33.02 IC4.13
MC00
  Top 0.406: IC6.9 419.1,27.94 419.89,27.15 419.89,26.19 405.76,12.07 321.31,12.07 321.31,9.53 320.04,8.26 SV2.7
MC01
  Top 0.406: SV2.5 322.58,8.26 323.85,9.53 323.85,11.43 406.4,11.43 420.53,25.56 420.53,29.05 419.1,30.48 IC6.11
MC02
  Top 0.406: IC12.3 444.5,29.21 442.6,29.21 442.6,52.71 447.68,57.79 453.39,57.79 453.39,24.13 440.06,10.8 440.06,10.16 328.93,10.16 328.93,9.53 328.3,8.89 325.12,8.89 325.12,8.26 SV2.3
MF00
  Top 0.406: SV1.1 104.14,8.26 105.41,9.53 105.41,10.16 201.93,10.16 217.81,26.04 224.79,33.02 224.79,41.91 222.88,41.91 222.25,41.28 222.25,38.1 217.17,33.02 IC9.13
MF01
  Top 0.406: IC4.5 248.6,29.21 248.6,25.72 248.6,7.62 SV2.35
MF02
  Top 0.406: IC4.1 247.65,34.29 250.19,34.29 250.19,26.04 250.19,11.43 285.75,11.43 285.75,9.53 287.02,8.26 SV2.33
MKT
  Top 0.406: IC10.13 311.15,33.02 311.15,41.91 313.69,41.91 313.69,22.38 299.72,22.38 SV2.24
MKTK
  Top 0.406: SV1.11 91.44,8.26 92.71,9.53 92.71,10.8 92.71,19.05 139.06,19.05 156.84,34.29 161.93,39.37 161.93,46.99 161.93,55.88 158.75,59.06 158.75,74.93 160.66,74.93 165.74,69.85 165.74,38.74 170.18,34.29 IC1.1
MR00
  Top 0.406: IC7.1 57.15,34.29 57.15,61.6 70.48,74.93 74.93,74.93 74.93,6.99 74.3,6.35 68.58,6.35 68.58,6.99 SV1.29
MR01
  Top 0.406: IC7.5 57.15,29.21 58.26,29.21 58.26,22.23 67.31,13.97 67.31,9.53 67.94,8.89 71.12,8.89 71.12,8.26 SV1.27
N$1
  Top 0.406: R1.2 USR0.K
N$2
  Top 0.406: R2.2 USR1.K
N$3
  Top 0.406: R3.2 USR2.K
N$4
  Top 0.406: R4.2 MR0.K
N$5
  Top 0.406: R5.2 MR1.K
N$6
  Top 0.406: R6.2 FR0.K
N$7
  Top 0.406: R7.2 FR1.K
N$8
  Top 0.406: R8.2 FR2.K
N$9
  Top 0.406: R9.2 FR3.K
N$10
  Top 0.406: R10.2 ENI.K
N$11
  Top 0.406: R11.2 EF.K
N$12
  Top 0.406: R12.2 MK.K
N$13
  Top 0.406: R13.2 END.K
N$14
  Top 0.406: R14.2 SE.K
N$15
  Top 0.406: R15.2 PAR.K
N$16
  Top 0.406: R16.2 TIM.K
N$17
  Top 0.406: R17.2 MF0.K
N$18
  Top 0.406: R18.2 MF1.K
N$19
  Top 0.406: R19.2 MF2.K
N$20
  Top 0.406: IC3.6 15.24,27.94 15.24,19.05 9.53,13.34 1.27,13.34 1.27,67.31 R1.1
N$21
  Top 0.406: R2.1 6.35,59.69 6.35,39.37 10.16,39.37 15.24,34.29 15.24,30.48 17.78,30.48 IC3.4
N$22
  Top 0.406: IC3.10 24.13,29.21 22.86,29.21 22.86,36.2 29.21,42.55 29.21,69.22 33.02,73.03 R3.1
N$23
  Top 0.406: IC7.2 55.88,33.02 46.99,41.91 46.99,71.76 45.72,73.03 R4.1
N$24
  Top 0.406: IC7.6 55.88,27.94 48.26,27.94 43.81,32.39 43.81,54.61 44.45,55.25 44.45,74.3 45.09,74.93 58.42,74.93 58.42,74.3 R5.1
N$25
  Top 0.406: IC7.10 62.23,29.21 60.96,29.21 60.96,36.83 67.31,43.18 67.31,69.22 71.12,73.03 R6.1
N$26
  Top 0.406: IC2.4 95.25,30.48 96.52,30.48 96.52,38.74 85.09,50.17 85.09,71.76 83.82,73.03 R7.1
N$27
  Top 0.406: IC2.8 100.33,26.67 98.42,26.67 98.42,71.12 96.52,73.03 R8.1
N$28
  Top 0.406: IC2.12 100.33,31.75 99.06,31.75 99.06,62.87 109.22,73.03 R9.1
N$29
  Top 0.406: IC8.4 133.35,30.48 134.62,30.48 134.62,34.93 133.35,36.2 123.83,36.2 123.83,71.12 121.92,73.03 R10.1
N$30
  Top 0.406: IC8.8 139.7,26.67 148.59,35.56 148.59,66.04 147.32,67.31 147.32,73.03 R11.1
N$31
  Top 0.406: R12.1 165.1,67.95 165.1,39.37 165.1,38.1 170.18,33.02 IC1.2
N$32
  Top 0.406: IC1.6 171.45,27.94 173.35,27.94 173.35,39.37 173.99,40.01 173.99,71.12 173.35,71.76 172.72,73.03 R13.1
N$33
  Top 0.406: IC1.10 176.53,29.21 174.62,29.21 174.62,38.1 175.9,38.1 175.9,73.66 184.78,73.66 R14.1 185.42,73.03
N$34
  Top 0.406: IC9.2 210.82,33.02 212.09,33.02 212.09,37.47 199.39,50.17 199.39,71.76 198.12,73.03 R15.1
N$35
  Top 0.406: 209.55,27.94 IC9.6 210.82,27.94 213.36,27.94 213.36,70.49 210.82,73.03 R16.1
N$36
  Top 0.406: R17.1 223.52,74.3 223.52,75.57 214.63,75.57 214.63,31.75 215.9,31.75 IC9.12
N$37
  Top 0.406: IC4.6 246.38,27.94 234.31,27.94 234.31,54.61 234.95,55.25 234.95,71.76 236.22,73.03 R18.1
N$38
  Top 0.406: R20.2 DTF.K
N$57
  Top 0.406: R21.2 DF.K
N$58
  Top 0.406: R22.2 W.K
N$59
  Top 0.406: R23.2 WC.K
N$60
  Top 0.406: R24.2 UTS.K
N$61
  Top 0.406: R25.2 BM.K
N$62
  Top 0.406: R26.2 RC.K
N$63
  Top 0.406: R27.2 D.K
N$64
  Top 0.406: R28.2 F.K
N$65
  Top 0.406: R29.2 CK.K
N$66
  Top 0.406: R30.2 IDLE.K
N$67
  Top 0.406: R31.2 MC0.K
N$68
  Top 0.406: R32.2 MC1.K
N$69
  Top 0.406: R33.2 MC2.K
N$70
  Top 0.406: R19.1 248.92,73.03 248.92,61.6 234.95,47.63 234.95,44.45 246.38,33.02 IC4.2
N$71
  Top 0.406: IC4.10 252.73,29.21 251.46,29.21 251.46,62.87 261.62,73.03 R20.1
N$72
  Top 0.406: IC10.6 297.18,27.94 285.75,39.37 285.75,71.76 287.02,73.03 R21.1
N$73
  Top 0.406: R23.1 302.26,63.5 302.26,29.21 303.53,29.21 IC10.10
N$74
  Top 0.406: IC10.2 297.18,33.02 296.23,33.97 296.23,53.02 298.45,55.25 298.45,71.76 299.72,73.03 R22.1
N$75
  Top 0.406: IC5.4 336.55,30.48 337.82,30.48 337.82,38.74 326.39,50.17 326.39,71.76 325.12,73.03 R24.1
N$76
  Top 0.406: R25.1 337.82,73.03 339.73,70.8 339.73,26.67 IC5.8
N$77
  Top 0.406: IC5.12 340.36,31.75 340.36,73.66 R26.1
N$78
  Top 0.406: IC11.4 374.65,30.48 375.92,30.48 375.92,38.74 364.49,50.17 364.49,71.76 363.22,73.03 R27.1
N$79
  Top 0.406: IC11.8 379.73,26.67 377.82,26.67 377.82,71.12 375.92,73.03 R28.1
N$80
  Top 0.406: IC11.12 381,31.75 386.71,37.47 386.71,54.61 387.35,55.25 387.35,71.76 388.62,73.03 R29.1
N$81
  Top 0.406: IC6.4 412.75,30.48 414.02,30.48 414.02,38.74 402.59,50.17 402.59,71.76 401.32,73.03 R30.1
N$82
  Top 0.406: IC6.8 417.83,26.67 415.93,26.67 415.93,36.83 416.56,37.47 416.56,62.23 415.93,62.87 415.93,71.76 414.02,73.03 R31.1
N$83
  Top 0.406: 417.19,64.14 416.56,63.5 | 417.19,64.14 R32.1 | IC6.10 417.83,29.21 416.56,29.21 416.56,36.2 417.19,36.83 417.19,64.14
N$84
  Top 0.406: R33.1 441.96,71.12 441.96,27.94 444.5,27.94 IC12.4
N$89
  Top 0.406: R34.1 DTB0.K
N$90
  Top 0.406: R35.1 DTB1.K
N$91
  Top 0.406: R36.1 DTB2.K
N$92
  Top 0.406: R37.1 DTB3.K
N$93
  Top 0.406: R38.1 DTB4.K
N$94
  Top 0.406: R39.1 DTB5.K
N$95
  Top 0.406: R40.1 DTB6.K
N$96
  Top 0.406: R41.1 DTB7.K
N$97
  Top 0.406: R42.1 DTB8.K
N$98
  Top 0.406: R43.1 DTB9.K
N$99
  Top 0.406: R44.1 DTB10.K
N$100
  Top 0.406: R45.1 DTB11.K
N$101
  Top 0.406: R46.1 WB0.K
N$102
  Top 0.406: R47.1 WB1.K
N$103
  Top 0.406: R48.1 WB2.K
N$104
  Top 0.406: LPB0.K R49.1
N$105
  Top 0.406: R50.1 LPB1.K
N$106
  Top 0.406: R51.1 LPB2.K
N$107
  Top 0.406: R52.1 LPB3.K
N$108
  Top 0.406: R53.1 LPB4.K
N$109
  Top 0.406: R54.1 LPB5.K
N$110
  Top 0.406: R55.1 C0.K
N$111
  Top 0.406: R56.1 C1.K
N$112
  Top 0.406: R57.1 MKT.K
N$113
  Top 0.406: R58.1 W0.K
N$114
  Top 0.406: R59.1 W1.K
N$115
  Top 0.406: R60.1 W2.K
N$116
  Top 0.406: R61.1 W3.K
N$117
  Top 0.406: R62.1 W4.K
N$118
  Top 0.406: R63.1 W5.K
N$119
  Top 0.406: R64.1 W6.K
N$120
  Top 0.406: R65.1 W7.K
N$121
  Top 0.406: R66.1 W8.K
N$122
  Top 0.406: WTM.K R67.1
N$123
  Top 0.406: R34.2 11.43,40.64 16.51,34.29 16.51,33.02 17.78,33.02 IC3.2
N$124
  Top 0.406: IC3.8 24.13,26.67 22.23,26.67 22.23,38.1 20.32,40.01 R35.2
N$125
  Top 0.406: R36.2 33.02,31.75 25.4,31.75 IC3.12
N$126
  Top 0.406: IC7.4 55.88,30.48 46.35,40.01 46.35,40.64 R37.2
N$127
  Top 0.406: R38.2 60.33,38.74 60.33,26.67 62.23,26.67 | 62.23,26.67 IC7.8 62.23,26.67
N$128
  Top 0.406: R39.2 71.12,31.75 63.5,31.75 IC7.12
N$129
  Top 0.406: R40.2 83.82,33.02 93.98,33.02 IC2.2
N$130
  Top 0.406: IC2.6 95.25,27.94 97.16,27.94 97.16,40.64 R41.2
N$131
  Top 0.406: IC2.10 101.6,29.21 109.22,36.83 109.22,40.01 R42.2
N$132
  Top 0.406: IC8.2 132.08,33.02 121.92,33.02 121.92,40.01 R43.2
N$133
  Top 0.406: R44.2 134.62,40.01 135.25,38.74 135.25,27.94 133.35,27.94 IC8.6
N$134
  Top 0.406: IC8.10 139.7,29.21 147.32,36.83 147.32,40.01 R45.2
N$135
  Top 0.406: IC8.12 139.7,31.75 146.05,38.1 146.05,74.3 146.69,74.93 156.21,74.93 156.21,45.09 160.02,41.28 R46.2
N$136
  Top 0.406: R47.2 172.72,30.48 171.45,30.48 IC1.4
N$137
  Top 0.406: IC1.8 177.8,26.67 185.42,34.29 185.42,40.01 R48.2
N$138
  Top 0.406: IC1.12 176.53,31.75 175.26,31.75 175.26,36.2 181.61,42.55 181.61,56.52 182.25,57.15 196.85,57.15 196.85,42.55 198.12,41.28 R49.2
N$139
  Top 0.406: IC9.4 210.82,30.48 212.72,30.48 212.72,38.1 210.82,40.01 R50.2
N$140
  Top 0.406: IC9.8 217.17,26.67 223.52,33.02 223.52,40.01 R51.2
N$141
  Top 0.406: R52.2 236.22,33.02 236.22,30.48 246.38,30.48 IC4.4
N$142
  Top 0.406: IC4.8 252.73,26.67 250.82,26.67 250.82,38.1 248.92,40.01 R53.2
N$143
  Top 0.406: R54.2 261.62,31.75 254,31.75 IC4.12
N$144
  Top 0.406: IC10.4 297.18,30.48 287.65,40.01 287.65,40.64 R55.2
N$145
  Top 0.406: IC10.8 303.53,26.67 301.62,26.67 301.62,38.1 299.72,40.01 R56.2
N$146
  Top 0.406: R57.2 312.42,31.75 304.8,31.75 IC10.12
N$147
  Top 0.406: R58.2 325.12,33.02 335.28,33.02 IC5.2
N$148
  Top 0.406: IC5.6 336.55,27.94 338.45,27.94 338.45,40.64 R59.2
N$149
  Top 0.406: IC5.10 342.9,29.21 350.52,36.83 350.52,40.01 R60.2
N$150
  Top 0.406: R61.2 363.22,33.02 373.38,33.02 IC11.2
N$151
  Top 0.406: IC11.6 374.65,27.94 376.56,27.94 376.56,40.64 R62.2
N$152
  Top 0.406: IC11.10 381,29.21 388.62,36.83 388.62,40.01 R63.2
N$153
  Top 0.406: R64.2 401.32,33.02 411.48,33.02 IC6.2
N$154
  Top 0.406: IC6.6 412.75,27.94 414.65,27.94 414.65,40.01 R65.2
N$155
  Top 0.406: R66.2 426.72,31.75 419.1,31.75 IC6.12
N$190
  Top 0.406: R67.2 450.85,41.91 450.85,57.15 448.31,57.15 443.23,52.07 443.23,30.48 444.5,30.48 IC12.2
PAR
  Top 0.406: IC9.1 187.96,34.29 187.96,33.02 169.23,14.45 168.75,14.45 100.33,14.45 100.33,9.53 99.06,8.26 SV1.5
SEL
  Top 0.406: 99.69,15.88 167,15.88 | 167,15.88 167.16,15.88 | IC1.11 177.8,30.48 184.15,36.83 184.15,41.28 184.78,41.91 186.69,41.91 186.69,34.29 168.28,15.88 167,15.88 | 97.79,15.88 97.79,12.7 97.79,9.53 96.52,8.26 SV1.7 | 97.79,15.88 99.69,15.88 | 97.79,15.88 99.69,15.88 | 97.79,15.88 99.69,15.88
ST_BLK_MK
  Top 0.406: IC5.9 342.9,27.94 343.69,27.15 343.69,26.19 342.26,24.77 316.87,24.77 316.87,19.84 306.07,19.84 306.07,9.53 304.8,8.26 SV2.19
ST_CK
  Top 0.406: IC11.13 378.46,33.02 378.46,65.41 387.99,74.93 390.52,74.93 390.52,23.5 381.32,14.61 316.23,14.61 316.23,9.53 314.96,8.26 SV2.11
ST_FINAL
  Top 0.406: SV2.13 312.42,8.26 313.69,9.53 313.69,15.88 378.46,15.88 381.79,17.3 381.79,27.31 381,27.94 IC11.9 379.73,27.94
ST_IDLE
  Top 0.406: IC6.3 411.48,31.75 392.43,13.34 318.77,13.34 318.77,9.53 317.5,8.26 SV2.9
ST_REV_CK
  Top 0.406: IC5.13 342.9,33.02 348.62,38.74 348.62,41.91 349.25,42.55 352.43,42.55 352.43,31.75 337.82,18.42 308.61,18.42 308.61,9.53 307.34,8.26 SV2.17
SWTM
  Top 0.406: 433.07,21.59 445.77,21.59 447.04,22.86 447.04,31.75 445.77,31.75 IC12.1 | 433.07,21.59 433.07,25.4 435.61,27.94 SWTM.2 | SV2.2 328.3,10.8 433.07,10.8 433.07,21.59
TIM
  Top 0.406: IC9.5 209.55,29.21 190.5,29.21 186.69,29.21 170.18,12.7 168.28,12.7 102.87,12.7 102.87,9.53 101.6,8.26 SV1.3
USR_00
  Top 0.406: SV1.35 38.1,7.62 37.47,7.62 20.32,24.77 20.32,29.21 19.05,29.21 | 19.05,29.21 IC3.5 19.05,29.21
USR_01
  Top 0.406: SV1.33 63.5,8.89 38.1,8.89 37.47,8.89 20.95,25.4 20.95,31.75 19.05,31.75 | 19.05,31.75 IC3.3 19.05,31.75
USR_02
  Top 0.406: IC3.11 25.4,30.48 26.67,30.48 43.81,13.34 64.77,13.34 64.77,9.53 66.04,8.26 SV1.31
UTS
  Top 0.406: IC5.3 315.6,31.75 315.6,21.11 303.53,21.11 303.53,9.53 302.26,8.26 SV2.21
VCC
  Top 0.406: W8.A 424.18,39.37 419.1,34.29 IC6.14 | W5.A 386.08,39.37 381,34.29 | 381,34.29 IC11.14 381,34.29 | 342.9,34.29 IC5.14 342.9,34.29 | MKT.A 309.88,39.37 304.8,34.29 IC10.14 | WTM.A 449.58,33.02 450.85,31.75 IC12.14 | DTB10.A 132.08,50.8 138.43,44.45 138.43,34.29 IC8.14 | LPB5.A 259.08,39.37 254,34.29 IC4.14 | WB2.A 182.88,39.37 177.8,34.29 IC1.14 | DTB5.A 68.58,39.37 63.5,34.29 IC7.14 | DTB2.A 30.48,39.37 25.4,34.29 IC3.14 | LPB2.A 220.98,38.1 217.17,34.29 IC9.14 | IC2.14 101.6,34.29 106.68,39.37 106.68,55.25 DTB8.A | 342.9,34.29 347.98,39.37 347.98,55.25 W2.A
  Bottom 0.406: USR0.A 6.35,90.17 16.51,90.17 | 16.51,90.17 USR1.A | 29.21,90.17 USR2.A | 29.21,90.17 16.51,90.17 | 41.91,90.17 MR0.A | 41.91,90.17 29.21,90.17 | 54.61,90.17 MR1.A | 54.61,90.17 41.91,90.17 | 67.31,90.17 FR0.A | 67.31,90.17 54.61,90.17 | 80.01,90.17 FR1.A | 80.01,90.17 67.31,90.17 | 92.71,90.17 FR2.A | 92.71,90.17 80.01,90.17 | 105.41,90.17 FR3.A | 105.41,90.17 92.71,90.17 | 118.11,90.17 ENI.A | 118.11,90.17 105.41,90.17 | 143.51,90.17 EF.A | 143.51,90.17 118.11,90.17 | 156.21,90.17 MK.A | 156.21,90.17 143.51,90.17 | 168.91,90.17 END.A | 168.91,90.17 156.21,90.17 | 181.61,90.17 SE.A | 181.61,90.17 168.91,90.17 | 194.31,90.17 PAR.A | 194.31,90.17 181.61,90.17 | 207.01,90.17 TIM.A | 207.01,90.17 194.31,90.17 | 219.71,90.17 MF0.A | 219.71,90.17 207.01,90.17 | 232.41,90.17 MF1.A | 232.41,90.17 219.71,90.17 | 245.11,90.17 MF2.A | 245.11,90.17 232.41,90.17 | 257.81,90.17 DTF.A | 257.81,90.17 245.11,90.17 | 283.21,90.17 DF.A | 283.21,90.17 257.81,90.17 | 295.91,90.17 W.A | 295.91,90.17 283.21,90.17 | 308.61,90.17 WC.A | 308.61,90.17 295.91,90.17 | 321.31,90.17 UTS.A | 321.31,90.17 308.61,90.17 | 334.01,90.17 BM.A | 334.01,90.17 321.31,90.17 | 346.71,90.17 RC.A | 346.71,90.17 334.01,90.17 | 359.41,90.17 D.A | 359.41,90.17 346.71,90.17 | 372.11,90.17 F.A | 372.11,90.17 359.41,90.17 | 384.81,90.17 CK.A | 384.81,90.17 372.11,90.17 | 397.51,90.17 IDLE.A | 397.51,90.17 384.81,90.17 | 410.21,90.17 MC0.A | 410.21,90.17 397.51,90.17 | 422.91,90.17 MC1.A | 422.91,90.17 410.21,90.17 | 422.91,90.17 435.61,90.17 MC2.A 436.88,57.15 | 295.91,57.15 285.75,57.15 C0.A 283.21,57.15 257.81,57.15 | 295.91,57.15 C1.A | 321.31,57.15 W0.A | 309.88,57.15 295.91,57.15 | 321.31,57.15 309.88,57.15 | 334.01,57.15 W1.A
  Bottom 0.406: 334.01,57.15 321.31,57.15 | 359.41,57.15 W3.A | 347.98,57.15 334.01,57.15 | 359.41,57.15 347.98,57.15 | 372.11,57.15 W4.A | 372.11,57.15 359.41,57.15 | 397.51,57.15 W6.A | 386.08,57.15 372.11,57.15 | 397.51,57.15 386.08,57.15 | 410.21,57.15 W7.A | 410.21,57.15 397.51,57.15 | WTM.A 448.31,57.15 436.88,57.15 | 424.18,57.15 410.21,57.15 | 436.88,57.15 424.18,57.15 | 309.88,57.15 MKT.A | 347.98,57.15 W2.A | 386.08,57.15 W5.A | 424.18,57.15 W8.A | DTB0.A 6.35,57.15 12.7,57.15 | 16.51,57.15 12.7,57.15 | 16.51,57.15 DTB1.A | 41.91,57.15 DTB3.A | 30.48,57.15 16.51,57.15 | 41.91,57.15 30.48,57.15 | 54.61,57.15 DTB4.A | 54.61,57.15 41.91,57.15 | 80.01,57.15 DTB6.A | 68.58,57.15 54.61,57.15 | 80.01,57.15 68.58,57.15 | 92.71,57.15 DTB7.A | 92.71,57.15 80.01,57.15 | 118.11,57.15 DTB9.A | 106.68,57.15 92.71,57.15 | 118.11,57.15 106.68,57.15 | 143.51,57.15 DTB11.A | 132.08,57.15 118.11,57.15 | 143.51,57.15 132.08,57.15 | 156.21,57.15 WB0.A | 156.21,57.15 143.51,57.15 | 168.91,57.15 WB1.A | 168.91,57.15 156.21,57.15 | 194.31,57.15 LPB0.A | 182.88,57.15 168.91,57.15 | 194.31,57.15 182.88,57.15 | 207.01,57.15 LPB1.A | 207.01,57.15 194.31,57.15 | 232.41,57.15 LPB3.A | 220.98,57.15 207.01,57.15 | 232.41,57.15 220.98,57.15 | 245.11,57.15 LPB4.A | 245.11,57.15 232.41,57.15 | 12.7,57.15 12.7,33.02 X4.1 | 8.89,20.32 X3.1 8.89,20.32 | X4.1 13.97,33.02 | 220.98,57.15 LPB2.A | 30.48,57.15 DTB2.A | 68.58,57.15 DTB5.A | 106.68,57.15 DTB8.A | 182.88,57.15 WB2.A | 257.81,57.15 LPB5.A | 257.81,57.15 245.11,57.15 | 132.08,57.15 DTB10.A | 8.89,20.32 16.51,27.94 16.51,33.02 13.97,33.02 | X4.1 13.97,33.02
W01
  Top 0.406: IC5.1 335.28,34.29 326.39,43.18 314.32,43.18 314.32,21.75 302.26,21.75 302.26,10.8 SV2.22
W02
  Top 0.406: IC5.5 316.23,29.21 316.23,20.48 304.8,20.48 SV2.20
W03
  Top 0.406: SV2.18 307.34,19.05 317.66,19.05 317.66,22.86 341.63,22.86 351.79,33.02 351.79,41.91 349.88,41.91 349.25,41.28 349.25,36.83 342.9,30.48 IC5.11
W04
  Top 0.406: IC11.1 373.38,34.29 364.49,43.18 353.06,43.18 353.06,31.12 338.45,17.78 309.88,17.78 SV2.16
W05
  Top 0.406: SV2.14 312.42,16.51 339.73,16.51 354.33,29.21 IC11.5
W06
  Top 0.406: IC11.11 381,30.48 387.35,36.83 387.35,41.28 387.99,41.91 389.89,41.91 389.89,24.13 381,15.24 377.19,15.24 314.96,15.24 314.96,10.8 SV2.12
W07
  Top 0.406: SV2.10 317.5,13.97 381.63,13.97 391.16,22.86 391.16,43.18 402.59,43.18 411.48,34.29 IC6.1
W08
  Top 0.406: IC6.5 411.48,29.21 410.21,29.21 393.06,12.7 320.04,12.7 320.04,10.8 SV2.8
W09
  Top 0.406: IC6.13 419.1,33.02 425.45,39.37 425.45,61.6 438.79,74.93 454.02,74.93 454.02,23.5 440.69,10.16 440.69,9.53 440.06,9.53 329.56,9.53 329.56,7.62 328.3,6.35 321.31,6.35 321.31,8.26 322.58,9.53 SV2.6
WB00
  Top 0.406: SV1.12 91.44,19.69 138.75,19.69 158.75,39.37 160.66,39.37 161.29,40.01 161.29,41.28 158.12,44.45 158.12,48.26 158.75,48.9 158.75,56.52 158.12,57.15 158.12,75.57 146.05,75.57 143.51,73.03 143.51,36.83 139.7,33.02 IC8.13
WB01
  Top 0.406: IC1.3 170.18,31.75 155.57,31.75 139.38,18.42 93.98,18.42 93.98,10.8 SV1.10
WB02
  Top 0.406: 176.53,27.94 IC1.9 176.53,27.94 | SV1.8 96.52,11.11 96.52,16.99 160.34,16.99 161.13,16.99 164.31,16.99 175.26,26.04 175.26,27.94 176.53,27.94
WC
  Top 0.406: IC10.11 307.34,30.48 307.34,23.02 298.45,23.02 298.45,8.89 SV2.23
WR_EN
  Top 0.406: SV2.25 295.91,8.89 295.91,24.29 300.99,24.29 300.99,34.29 IC10.1

### Text on the board
Document: USR | MR | FR | ENI | EF | MK | END | SE | PAR | TIM | MF | DTF | DF | W | UTS | STATE | WC | MC | 0 | 1 | 2 | 0 | 1 | 0 | 1 | 2 | 3 | 0 | 1 | 2 | BM | RC | D | F | CK | 0 | 1 | 2 | DTB | WB | LPB | C0 | C1 | MKT | WINDOW | WTM | 0 | 1 | 2 | 3 | 4 | 5 | 6 | 7 | 8 | 9 | 10 | 11 | 0 | 1 | 2 | 0 | 1 | 2 | 3 | 4 | 5 | 1 | 2 | 3 | 4 | 5 | 6 | 7 | 8 | 9